# Altium schematic sheet Sitara_Connectors.SchDoc
size A4; SheetNumber: 10; SheetTotal: 11
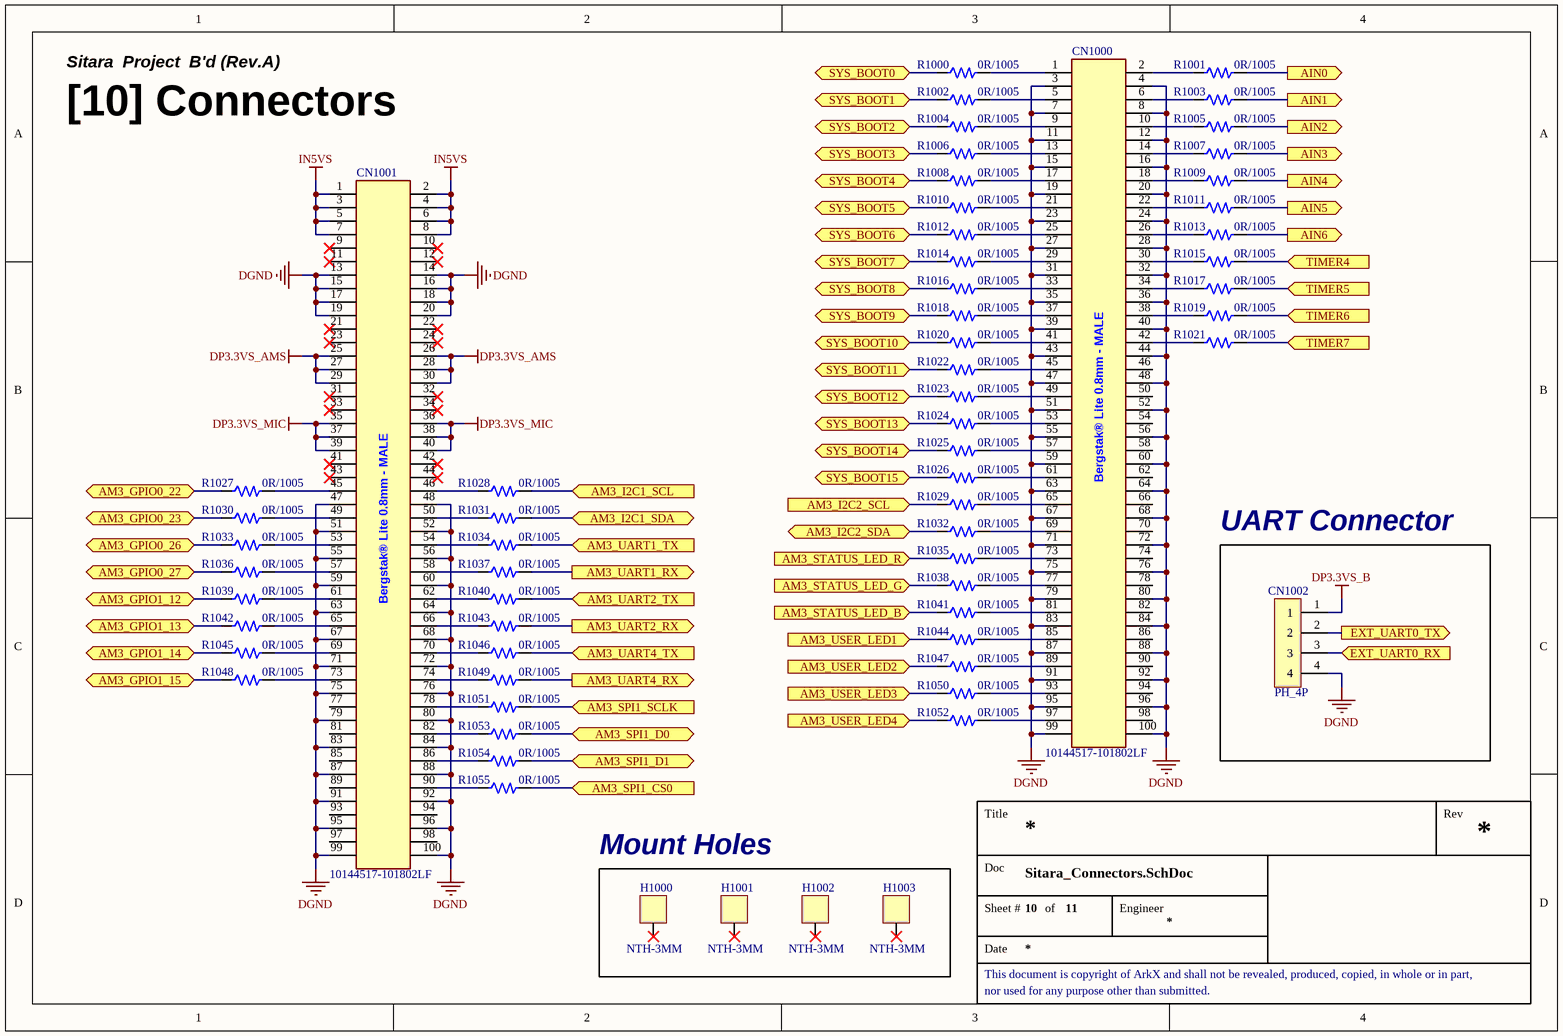
[diagram p0: Sitara_Connectors.SchDoc]

## Parts
CN1000  10144517-101802LF  [CON_BergStak-Lite(0.8mm)_MALE-100P(10144517-101802LF)_HandSolder]
CN1001  10144517-101802LF  [CON_BergStak-Lite(0.8mm)_MALE-100P(10144517-101802LF)_HandSolder]
CN1002  PH_4P  [CON PIN_HEADER-4PIN(2.54MM)]
H1000  NTH-3MM  [HOLE NTH-3MM]
H1001  NTH-3MM  [HOLE NTH-3MM]
H1002  NTH-3MM  [HOLE NTH-3MM]
H1003  NTH-3MM  [HOLE NTH-3MM]
R1000  0R/1005  [RES 1005 (0402_inch)]
R1001  0R/1005  [RES 1005 (0402_inch)]
R1002  0R/1005  [RES 1005 (0402_inch)]
R1003  0R/1005  [RES 1005 (0402_inch)]
R1004  0R/1005  [RES 1005 (0402_inch)]
R1005  0R/1005  [RES 1005 (0402_inch)]
R1006  0R/1005  [RES 1005 (0402_inch)]
R1007  0R/1005  [RES 1005 (0402_inch)]
R1008  0R/1005  [RES 1005 (0402_inch)]
R1009  0R/1005  [RES 1005 (0402_inch)]
R1010  0R/1005  [RES 1005 (0402_inch)]
R1011  0R/1005  [RES 1005 (0402_inch)]
R1012  0R/1005  [RES 1005 (0402_inch)]
R1013  0R/1005  [RES 1005 (0402_inch)]
R1014  0R/1005  [RES 1005 (0402_inch)]
R1015  0R/1005  [RES 1005 (0402_inch)]
R1016  0R/1005  [RES 1005 (0402_inch)]
R1017  0R/1005  [RES 1005 (0402_inch)]
R1018  0R/1005  [RES 1005 (0402_inch)]
R1019  0R/1005  [RES 1005 (0402_inch)]
R1020  0R/1005  [RES 1005 (0402_inch)]
R1021  0R/1005  [RES 1005 (0402_inch)]
R1022  0R/1005  [RES 1005 (0402_inch)]
R1023  0R/1005  [RES 1005 (0402_inch)]
R1024  0R/1005  [RES 1005 (0402_inch)]
R1025  0R/1005  [RES 1005 (0402_inch)]
R1026  0R/1005  [RES 1005 (0402_inch)]
R1027  0R/1005  [RES 1005 (0402_inch)]
R1028  0R/1005  [RES 1005 (0402_inch)]
R1029  0R/1005  [RES 1005 (0402_inch)]
R1030  0R/1005  [RES 1005 (0402_inch)]
R1031  0R/1005  [RES 1005 (0402_inch)]
R1032  0R/1005  [RES 1005 (0402_inch)]
R1033  0R/1005  [RES 1005 (0402_inch)]
R1034  0R/1005  [RES 1005 (0402_inch)]
R1035  0R/1005  [RES 1005 (0402_inch)]
R1036  0R/1005  [RES 1005 (0402_inch)]
R1037  0R/1005  [RES 1005 (0402_inch)]
R1038  0R/1005  [RES 1005 (0402_inch)]
R1039  0R/1005  [RES 1005 (0402_inch)]
R1040  0R/1005  [RES 1005 (0402_inch)]
R1041  0R/1005  [RES 1005 (0402_inch)]
R1042  0R/1005  [RES 1005 (0402_inch)]
R1043  0R/1005  [RES 1005 (0402_inch)]
R1044  0R/1005  [RES 1005 (0402_inch)]
R1045  0R/1005  [RES 1005 (0402_inch)]
R1046  0R/1005  [RES 1005 (0402_inch)]
R1047  0R/1005  [RES 1005 (0402_inch)]
R1048  0R/1005  [RES 1005 (0402_inch)]
R1049  0R/1005  [RES 1005 (0402_inch)]
R1050  0R/1005  [RES 1005 (0402_inch)]
R1051  0R/1005  [RES 1005 (0402_inch)]
R1052  0R/1005  [RES 1005 (0402_inch)]
R1053  0R/1005  [RES 1005 (0402_inch)]
R1054  0R/1005  [RES 1005 (0402_inch)]
R1055  0R/1005  [RES 1005 (0402_inch)]

## Blocks framed on the sheet
UART Connector: CN1002
Mount Holes: H1000-H1003

## Ports
AIN0 (out), AIN1 (out), AIN2 (out), AIN3 (out), AIN4 (out), AIN5 (out), AIN6 (out), AM3_GPIO0_22 (bidir), AM3_GPIO0_23 (bidir), AM3_GPIO0_26 (bidir), AM3_GPIO0_27 (bidir), AM3_GPIO1_12 (bidir), AM3_GPIO1_13 (bidir), AM3_GPIO1_14 (bidir), AM3_GPIO1_15 (bidir), AM3_I2C1_SCL (in), AM3_I2C1_SDA (bidir), AM3_I2C2_SCL (in), AM3_I2C2_SDA (bidir), AM3_SPI1_CS0 (in), AM3_SPI1_D0 (bidir), AM3_SPI1_D1 (bidir), AM3_SPI1_SCLK (in), AM3_STATUS_LED_B (in), AM3_STATUS_LED_G (in), AM3_STATUS_LED_R (in), AM3_UART1_RX (out), AM3_UART1_TX (in), AM3_UART2_RX (out), AM3_UART2_TX (in), AM3_UART4_RX (out), AM3_UART4_TX (in), AM3_USER_LED1 (in), AM3_USER_LED2 (in), AM3_USER_LED3 (in), AM3_USER_LED4 (in), EXT_UART0_RX (in), EXT_UART0_TX (out), SYS_BOOT0 (bidir), SYS_BOOT1 (bidir), SYS_BOOT2 (bidir), SYS_BOOT3 (bidir), SYS_BOOT4 (bidir), SYS_BOOT5 (bidir), SYS_BOOT6 (bidir), SYS_BOOT7 (bidir), SYS_BOOT8 (bidir), SYS_BOOT9 (bidir), SYS_BOOT10 (bidir), SYS_BOOT11 (bidir), SYS_BOOT12 (bidir), SYS_BOOT13 (bidir), SYS_BOOT14 (bidir), SYS_BOOT15 (bidir), TIMER4 (in), TIMER5 (in), TIMER6 (in), TIMER7 (in)

## Nets
DGND: CN1000.3 CN1000.4 CN1000.7 CN1000.8 CN1000.11 CN1000.12 CN1000.15 CN1000.16 CN1000.19 CN1000.20 CN1000.23 CN1000.24 CN1000.27 CN1000.28 CN1000.31 CN1000.32 CN1000.35 CN1000.36 CN1000.39 CN1000.40 CN1000.43 CN1000.44 CN1000.47 CN1000.48 CN1000.51 CN1000.52 CN1000.55 CN1000.56 CN1000.59 CN1000.60 CN1000.63 CN1000.64 CN1000.67 CN1000.68 CN1000.71 CN1000.72 CN1000.75 CN1000.76 CN1000.79 CN1000.80 CN1000.83 CN1000.84 CN1000.87 CN1000.88 CN1000.91 CN1000.92 CN1000.95 CN1000.96 CN1000.99 CN1000.100 CN1001.13 CN1001.14 CN1001.15 CN1001.16 CN1001.17 CN1001.18 CN1001.19 CN1001.20 CN1001.47 CN1001.48 CN1001.51 CN1001.52 CN1001.55 CN1001.56 CN1001.59 CN1001.60 CN1001.63 CN1001.64 CN1001.67 CN1001.68 CN1001.71 CN1001.72 CN1001.75 CN1001.76 CN1001.79 CN1001.80 CN1001.83 CN1001.84 CN1001.87 CN1001.88 CN1001.91 CN1001.92 CN1001.95 CN1001.96 CN1001.99 CN1001.100 CN1002.4
DP3.3VS_AMS: CN1001.25 CN1001.26 CN1001.27 CN1001.28 CN1001.29 CN1001.30
DP3.3VS_B: CN1002.1
DP3.3VS_MIC: CN1001.35 CN1001.36 CN1001.37 CN1001.38 CN1001.39 CN1001.40
IN5VS: CN1001.1 CN1001.2 CN1001.3 CN1001.4 CN1001.5 CN1001.6 CN1001.7 CN1001.8
AIN0: R1001.2 ; port AIN0
AIN1: R1003.2 ; port AIN1
AIN2: R1005.2 ; port AIN2
AIN3: R1007.2 ; port AIN3
AIN4: R1009.2 ; port AIN4
AIN5: R1011.2 ; port AIN5
AIN6: R1013.2 ; port AIN6
AM3_GPIO0_22: R1027.1 ; port AM3_GPIO0_22
AM3_GPIO0_23: R1030.1 ; port AM3_GPIO0_23
AM3_GPIO0_26: R1033.1 ; port AM3_GPIO0_26
AM3_GPIO0_27: R1036.1 ; port AM3_GPIO0_27
AM3_GPIO1_12: R1039.1 ; port AM3_GPIO1_12
AM3_GPIO1_13: R1042.1 ; port AM3_GPIO1_13
AM3_GPIO1_14: R1045.1 ; port AM3_GPIO1_14
AM3_GPIO1_15: R1048.1 ; port AM3_GPIO1_15
AM3_I2C1_SCL: R1028.2 ; port AM3_I2C1_SCL
AM3_I2C1_SDA: R1031.2 ; port AM3_I2C1_SDA
AM3_I2C2_SCL: R1029.1 ; port AM3_I2C2_SCL
AM3_I2C2_SDA: R1032.1 ; port AM3_I2C2_SDA
AM3_SPI1_CS0: R1055.2 ; port AM3_SPI1_CS0
AM3_SPI1_D0: R1053.2 ; port AM3_SPI1_D0
AM3_SPI1_D1: R1054.2 ; port AM3_SPI1_D1
AM3_SPI1_SCLK: R1051.2 ; port AM3_SPI1_SCLK
AM3_STATUS_LED_B: R1041.1 ; port AM3_STATUS_LED_B
AM3_STATUS_LED_G: R1038.1 ; port AM3_STATUS_LED_G
AM3_STATUS_LED_R: R1035.1 ; port AM3_STATUS_LED_R
AM3_UART1_RX: R1037.2 ; port AM3_UART1_RX
AM3_UART1_TX: R1034.2 ; port AM3_UART1_TX
AM3_UART2_RX: R1043.2 ; port AM3_UART2_RX
AM3_UART2_TX: R1040.2 ; port AM3_UART2_TX
AM3_UART4_RX: R1049.2 ; port AM3_UART4_RX
AM3_UART4_TX: R1046.2 ; port AM3_UART4_TX
AM3_USER_LED1: R1044.1 ; port AM3_USER_LED1
AM3_USER_LED2: R1047.1 ; port AM3_USER_LED2
AM3_USER_LED3: R1050.1 ; port AM3_USER_LED3
AM3_USER_LED4: R1052.1 ; port AM3_USER_LED4
EXT_UART0_RX: CN1002.3 ; port EXT_UART0_RX
EXT_UART0_TX: CN1002.2 ; port EXT_UART0_TX
SYS_BOOT0: R1000.1 ; port SYS_BOOT0
SYS_BOOT1: R1002.1 ; port SYS_BOOT1
SYS_BOOT2: R1004.1 ; port SYS_BOOT2
SYS_BOOT3: R1006.1 ; port SYS_BOOT3
SYS_BOOT4: R1008.1 ; port SYS_BOOT4
SYS_BOOT5: R1010.1 ; port SYS_BOOT5
SYS_BOOT6: R1012.1 ; port SYS_BOOT6
SYS_BOOT7: R1014.1 ; port SYS_BOOT7
SYS_BOOT8: R1016.1 ; port SYS_BOOT8
SYS_BOOT9: R1018.1 ; port SYS_BOOT9
SYS_BOOT10: R1020.1 ; port SYS_BOOT10
SYS_BOOT11: R1022.1 ; port SYS_BOOT11
SYS_BOOT12: R1023.1 ; port SYS_BOOT12
SYS_BOOT13: R1024.1 ; port SYS_BOOT13
SYS_BOOT14: R1025.1 ; port SYS_BOOT14
SYS_BOOT15: R1026.1 ; port SYS_BOOT15
TIMER4: R1015.2 ; port TIMER4
TIMER5: R1017.2 ; port TIMER5
TIMER6: R1019.2 ; port TIMER6
TIMER7: R1021.2 ; port TIMER7
NetCN1000_1: CN1000.1 R1000.2
NetCN1000_2: CN1000.2 R1001.1
NetCN1000_5: CN1000.5 R1002.2
NetCN1000_6: CN1000.6 R1003.1
NetCN1000_9: CN1000.9 R1004.2
NetCN1000_10: CN1000.10 R1005.1
NetCN1000_13: CN1000.13 R1006.2
NetCN1000_14: CN1000.14 R1007.1
NetCN1000_17: CN1000.17 R1008.2
NetCN1000_18: CN1000.18 R1009.1
NetCN1000_21: CN1000.21 R1010.2
NetCN1000_22: CN1000.22 R1011.1
NetCN1000_25: CN1000.25 R1012.2
NetCN1000_26: CN1000.26 R1013.1
NetCN1000_29: CN1000.29 R1014.2
NetCN1000_30: CN1000.30 R1015.1
NetCN1000_33: CN1000.33 R1016.2
NetCN1000_34: CN1000.34 R1017.1
NetCN1000_37: CN1000.37 R1018.2
NetCN1000_38: CN1000.38 R1019.1
NetCN1000_41: CN1000.41 R1020.2
NetCN1000_42: CN1000.42 R1021.1
NetCN1000_45: CN1000.45 R1022.2
NetCN1000_49: CN1000.49 R1023.2
NetCN1000_53: CN1000.53 R1024.2
NetCN1000_57: CN1000.57 R1025.2
NetCN1000_61: CN1000.61 R1026.2
NetCN1000_65: CN1000.65 R1029.2
NetCN1000_69: CN1000.69 R1032.2
NetCN1000_73: CN1000.73 R1035.2
NetCN1000_77: CN1000.77 R1038.2
NetCN1000_81: CN1000.81 R1041.2
NetCN1000_85: CN1000.85 R1044.2
NetCN1000_89: CN1000.89 R1047.2
NetCN1000_93: CN1000.93 R1050.2
NetCN1000_97: CN1000.97 R1052.2
NetCN1001_45: CN1001.45 R1027.2
NetCN1001_46: CN1001.46 R1028.1
NetCN1001_49: CN1001.49 R1030.2
NetCN1001_50: CN1001.50 R1031.1
NetCN1001_53: CN1001.53 R1033.2
NetCN1001_54: CN1001.54 R1034.1
NetCN1001_57: CN1001.57 R1036.2
NetCN1001_58: CN1001.58 R1037.1
NetCN1001_61: CN1001.61 R1039.2
NetCN1001_62: CN1001.62 R1040.1
NetCN1001_65: CN1001.65 R1042.2
NetCN1001_66: CN1001.66 R1043.1
NetCN1001_69: CN1001.69 R1045.2
NetCN1001_70: CN1001.70 R1046.1
NetCN1001_73: CN1001.73 R1048.2
NetCN1001_74: CN1001.74 R1049.1
NetCN1001_78: CN1001.78 R1051.1
NetCN1001_82: CN1001.82 R1053.1
NetCN1001_86: CN1001.86 R1054.1
NetCN1001_90: CN1001.90 R1055.1

Not connected (* = marked no-connect by the designer): CN1000 46 50 54 58 62 66 70 74 78 82 86 90 94 98; CN1001 9* 10* 11* 12* 21* 22* 23* 24* 31* 32* 33* 34* 41* 42* 43* 44* 77 81 85 89 93 94 97 98; H1000 1*; H1001 1*; H1002 1*; H1003 1*

## Notes on the sheet
- Sitara  Project  B'd (Rev.A)
- [10] Connectors
- Title
- Rev
- Doc
- Sheet #
- of
- Engineer
- This document is copyright of ArkX and shall not be revealed, produced, copied, in whole or in part,
- Date
- nor used for any purpose other than submitted.
- (in symbol CON_BergStak-Lite(0.8mm)_MALE-100P(10144517-101802LF)) Bergstak® Lite 0.8mm - MALE

## Library data of the parts
CN1000 CN1001 = CON_BergStak-Lite(0.8mm)_MALE-100P(10144517-101802LF): JLCPCB Part Type: Extended Part
CN1002 = CON_PIN_HEADER_SINGLE-4PIN(2.54MM)
H1000-H1003 = HOLE_NTH-3MM: Non-Through Hole 3mm
R1000-R1055 = RES_0R/1005/62.5mW: Value: 0R; Power Rating: 62.5mW; Precision: 1%; Size: 1005; LCSC Part #: C17168; JLCPCB Part Type: Basic Part